# EAGLE schematic HV_SNS_V0.1 (EAGLE 9.6.2)
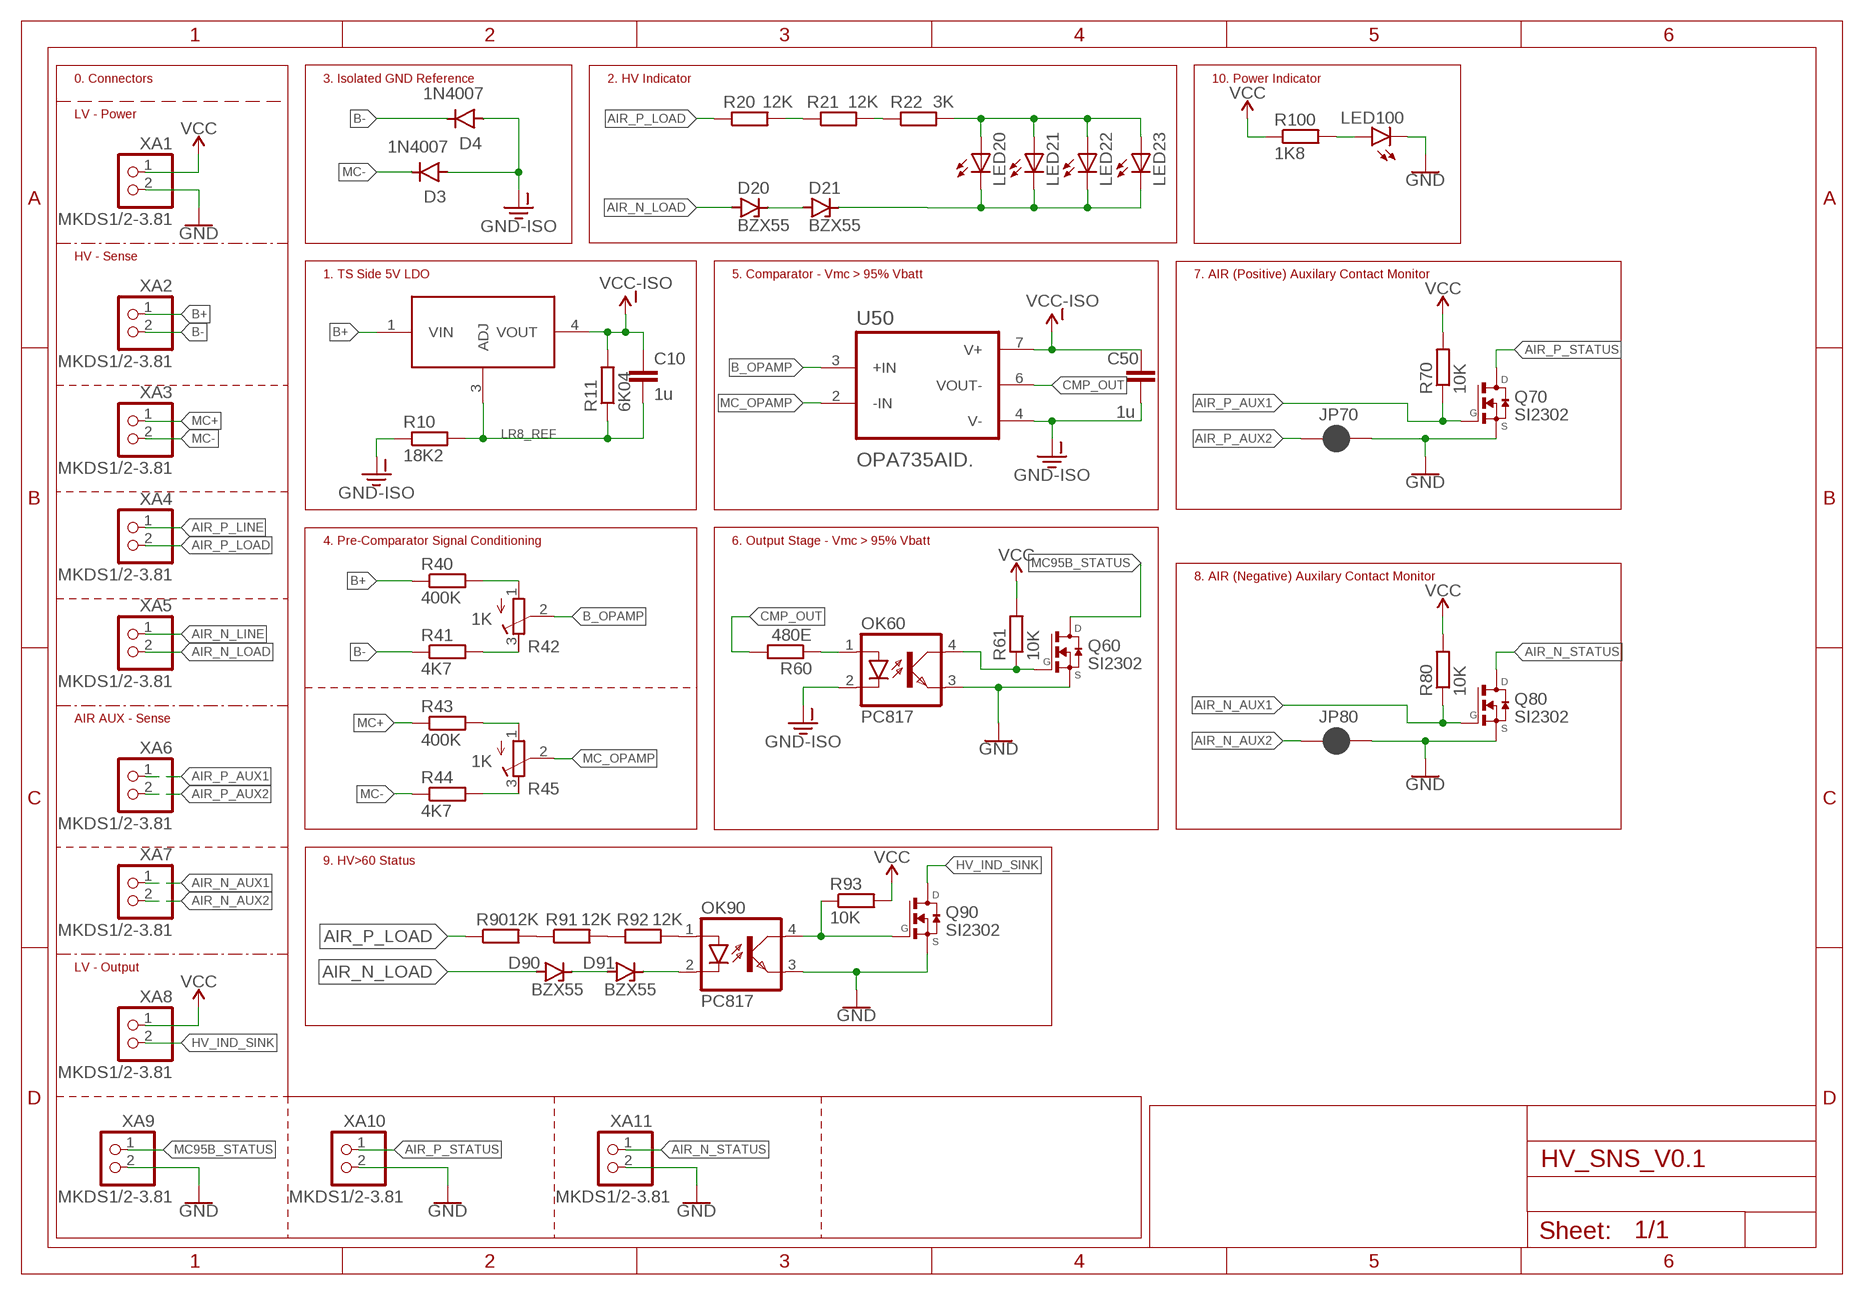
[diagram p0: schematic, sheet 1]

## Parts
C10  1u  C-EUC0805  [C0805]
C50  1u  C-EUC0805  [C0805]
D3  1N4007  [DO-41]
D4  1N4007  [DO-41]
D20  BZX55  [DO35Z10]
D21  BZX55  [DO35Z10]
D90  BZX55  [DO35Z10]
D91  BZX55  [DO35Z10]
JP70  JUMPER-SMT_2_NC_PASTE_SILK  [SMT-JUMPER_2_NC_PASTE_SILK]
JP80  JUMPER-SMT_2_NC_PASTE_SILK  [SMT-JUMPER_2_NC_PASTE_SILK]
LED20  LED5MM  [LED5MM]
LED21  LED5MM  [LED5MM]
LED22  LED5MM  [LED5MM]
LED23  LED5MM  [LED5MM]
LED100  LEDCHIP-LED0805  [CHIP-LED0805]
OK60  PC817  [DIL04]
OK90  PC817  [DIL04]
Q60  SI2302  [SOT23]
Q70  SI2302  [SOT23]
Q80  SI2302  [SOT23]
Q90  SI2302  [SOT23]
R10  18K2  R-EU_R0805  [R0805]
R11  6K04  R-EU_R0805  [R0805]
R20  12K  R-EU_0207/10  [0207/10]
R21  12K  R-EU_0207/10  [0207/10]
R22  3K  R-EU_0207/10  [0207/10]
R40  400K  R-EU_0207/10  [0207/10]
R41  4K7  R-EU_0207/10  [0207/10]
R42  1K  R-TRIMM3296W  [RTRIM3296W]
R43  400K  R-EU_0207/10  [0207/10]
R44  4K7  R-EU_0207/10  [0207/10]
R45  1K  R-TRIMM3296W  [RTRIM3296W]
R60  480E  R-EU_R0805  [R0805]
R61  10K  R-EU_R0805  [R0805]
R70  10K  R-EU_R0805  [R0805]
R80  10K  R-EU_R0805  [R0805]
R90  12K  R-EU_0207/10  [0207/10]
R91  12K  R-EU_0207/10  [0207/10]
R92  12K  R-EU_0207/10  [0207/10]
R93  10K  R-EU_R0805  [R0805]
R100  1K8  R-EU_R0805  [R0805]
U10  LR8K4-G  [PMX42_DPAK]
U50  OPA735AID.  [SO-8]
XA1  MKDS1/2-3.81  [PHOENIX_MKDS1/2-3.81]
XA2  MKDS1/2-3.81  [PHOENIX_MKDS1/2-3.81]
XA3  MKDS1/2-3.81  [PHOENIX_MKDS1/2-3.81]
XA4  MKDS1/2-3.81  [PHOENIX_MKDS1/2-3.81]
XA5  MKDS1/2-3.81  [PHOENIX_MKDS1/2-3.81]
XA6  MKDS1/2-3.81  [PHOENIX_MKDS1/2-3.81]
XA7  MKDS1/2-3.81  [PHOENIX_MKDS1/2-3.81]
XA8  MKDS1/2-3.81  [PHOENIX_MKDS1/2-3.81]
XA9  MKDS1/2-3.81  [PHOENIX_MKDS1/2-3.81]
XA10  MKDS1/2-3.81  [PHOENIX_MKDS1/2-3.81]
XA11  MKDS1/2-3.81  [PHOENIX_MKDS1/2-3.81]

## Nets
AIR_N_AUX1: Q80.1(G) R80.1 XA7.1
AIR_N_AUX2: JP80.1 XA7.2
AIR_N_LINE: XA5.1
AIR_N_LOAD: D20.A D90.A XA5.2
AIR_N_STATUS: Q80.3(D) XA11.1
AIR_P_AUX1: Q70.1(G) R70.1 XA6.1
AIR_P_AUX2: JP70.1 XA6.2
AIR_P_LINE: XA4.1
AIR_P_LOAD: R20.1 R90.1 XA4.2
AIR_P_STATUS: Q70.3(D) XA10.1
B+: R40.1 U10.1(VIN) XA2.1
B-: D4.C R41.1 XA2.2
B_OPAMP: R42.2(S) U50.3(+IN)
CMP_OUT: R60.2 U50.6(VOUT-)
GND: JP70.2 JP80.2 LED100.C OK60.3(EMIT) OK90.3(EMIT) Q60.2(S) Q70.2(S) Q80.2(S) Q90.2(S) XA1.2 XA9.2 XA10.2 XA11.2
GND-ISO: C50.2 D3.A D4.A OK60.2(C) R10.1 U50.4(V-)
HV_IND_SINK: Q90.3(D) XA8.2
LR8_REF: C10.2 R10.2 R11.1 U10.3(ADJ)
MC95B_STATUS: Q60.3(D) XA9.1
MC+: R43.1 XA3.1
MC-: D3.C R44.1 XA3.2
MC_OPAMP: R45.2(S) U50.2(-IN)
N$1: D20.C D21.A
N$2: LED20.A LED21.A LED22.A LED23.A R22.2
N$3: D21.C LED20.K(C) LED21.K(C) LED22.K(C) LED23.K(C)
N$4: OK90.4(COL) Q90.1(G) R93.1
N$5: R43.2 R45.1(A)
N$6: R44.2 R45.3(E)
N$7: R41.2 R42.3(E)
N$8: R40.2 R42.1(A)
N$9: OK60.1(A) R60.1
N$10: OK60.4(COL) Q60.1(G) R61.1
N$11: R20.2 R21.1
N$12: R21.2 R22.1
N$13: OK90.1(A) R92.2
N$14: R91.2 R92.1
N$15: R90.2 R91.1
N$16: D91.C OK90.2(C)
N$17: D90.C D91.A
N$18: LED100.A R100.2
VCC: R61.2 R70.2 R80.2 R93.2 R100.1 XA1.1 XA8.1
VCC-ISO: C10.1 C50.1 R11.2 U10.4(VOUT) U50.7(V+)

## Notes on the sheet
- 0. Connectors | 3. Isolated GND Reference | 2. HV Indicator | 10. Power Indicator
- LV - Power
- HV - Sense
- 1. TS Side 5V LDO | 5. Comparator - Vmc > 95% Vbatt | 7. AIR (Positive) Auxilary Contact Monitor
- 4. Pre-Comparator Signal Conditioning | 6. Output Stage - Vmc > 95% Vbatt
- 8. AIR (Negative) Auxilary Contact Monitor
- AIR AUX - Sense
- 9. HV>60 Status
- LV - Output

## Library data of the parts
C10 C50 = rcl:C-EU: CAPACITOR, European symbol; SPICEPREFIX: C
D3 D4 = Diodes:1N4007: DIODE GEN PURP 1KV 1A DO41 Manufacturer's datasheet <https://www.mccsemi.com/pdf/Products/1N4001-1N4007(DO-41).pdf>; CREATED_BY: PCBLayout.com; DIGIKEY_PART_NUMBER: 1N4007MSCT-ND; MANUFACTURER: Micro Commercial Co; MPN: 1N4007; PACKAGE: DO-41
D20 D21 D90 D91 = diode:BZX55: Z DIODE
JP70 JP80 = SparkFun-Jumpers:JUMPER-SMT_2_NC_PASTE: Normally closed solder jumper This jumper has an aperture in the stencil to allow solder paste to bridge the split in the wire so it's normally closed (NC). Wick off the solder to open the connection. Reapply solder to reclose the connection.
LED20-LED23 = adafruit:LED: LED
LED100 = led:LED: LED
OK60 OK90 = optocoupler:PC817: SHARP OPTO COUPLER; MPN: PC817X4J000F; OC_FARNELL: 9707727; OC_NEWARK: 97K7059
Q60 Q70 Q80 Q90 = SI230x:SI2302: MOSFET N-Channel 20 V (D-S); AVAILABILITY: Unavailable; DESCRIPTION: N-Channel 20V 2.6A _Ta_ 710mW _Ta_ Surface Mount SOT-23-3 _TO-236_; MF: Vishay Siliconix; MP: SI2302; PACKAGE: SOT-23-3 Vishay Siliconix; PRICE: None
R10 R11 R20-R22 R40 R41 R43 R44 R60 R61 R70 R80 R90-R93 R100 = rcl:R-EU_: RESISTOR, European symbol; SPICEPREFIX: R
R42 R45 = rcl:R-TRIMM: Trimm resistor; SPICEMODEL: X; SPICEPREFIXL: POT
U10 = LR8K4-G:LR8K4-G
U50 = OPA735AID:OPA735AID: Check prices <https://pricing.snapeda.com/parts/OPA735AID/Texas%20Instruments/view-part?ref=eda>
XA1-XA11 = MKDS1_2-3.81:MKDS1/2-3.81: Conn PC Terminal Block 2 POS 3.81mm Solder ST Thru-Hole 13.5A; AVAILABILITY: Unavailable; DESCRIPTION: 12 Position Wire to Board Terminal Block Horizontal with Board 0.150 (3.81mm) Through Hole; MF: Phoenix Contact; MP: MKDS 1/ 2-3.81; PACKAGE: None; PRICE: None